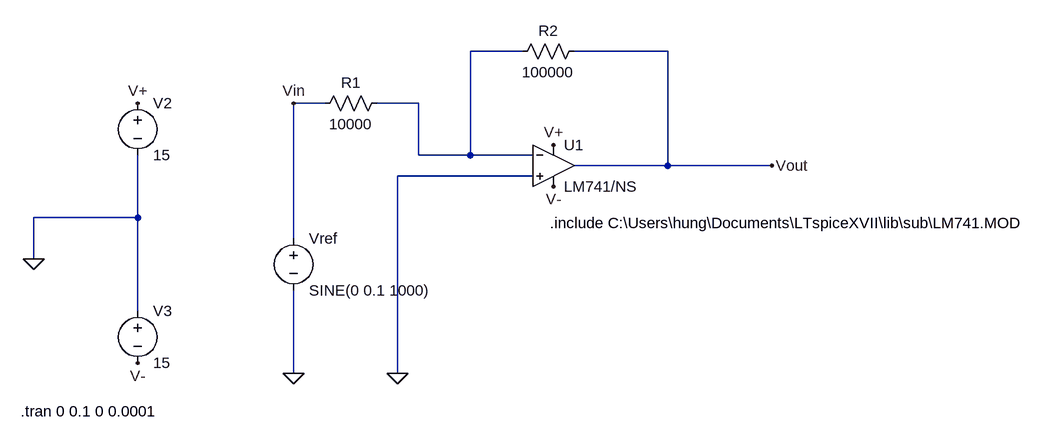
[diagram p0: schematic lab 7 start.asc]
lab 7 start.asc, the LTspice schematic file:
Version 4
SHEET 1 1036 680
WIRE 208 -112 128 -112
WIRE 432 -112 288 -112
WIRE -96 -32 -144 -32
WIRE 48 -32 -16 -32
WIRE 48 48 48 -32
WIRE 128 48 128 -112
WIRE 128 48 48 48
WIRE 224 48 128 48
WIRE 432 64 432 -112
WIRE 432 64 288 64
WIRE 592 64 432 64
WIRE 224 80 16 80
WIRE -384 144 -384 48
WIRE -384 144 -544 144
WIRE -144 176 -144 -32
WIRE -544 208 -544 144
WIRE -384 288 -384 144
WIRE -144 384 -144 256
WIRE 16 384 16 80
FLAG 256 32 V+
FLAG 256 96 V-
FLAG 592 64 Vout
FLAG -544 208 0
FLAG -144 384 0
FLAG 16 384 0
FLAG -384 -32 V+
FLAG -384 368 V-
FLAG -144 -32 Vin
SYMBOL Opamps\\opamp2 256 0 R0
SYMATTR InstName U1
SYMATTR Value LM741/NS
SYMBOL voltage -384 -48 R0
WINDOW 123 0 0 Left 0
WINDOW 39 0 0 Left 0
SYMATTR InstName V2
SYMATTR Value 15
SYMBOL voltage -384 272 R0
WINDOW 123 0 0 Left 0
WINDOW 39 0 0 Left 0
SYMATTR InstName V3
SYMATTR Value 15
SYMBOL voltage -144 160 R0
WINDOW 123 0 0 Left 0
WINDOW 39 0 0 Left 0
SYMATTR InstName Vref
SYMATTR Value SINE(0 0.1 1000)
SYMBOL res 0 -48 R90
WINDOW 0 0 56 VBottom 2
WINDOW 3 32 56 VTop 2
SYMATTR InstName R1
SYMATTR Value 10000
SYMBOL res 304 -128 R90
WINDOW 0 0 56 VBottom 2
WINDOW 3 32 56 VTop 2
SYMATTR InstName R2
SYMATTR Value 100000
TEXT 616 168 Bottom 2 !.include C:\\Users\\hung\\Documents\\LTspiceXVII\\lib\\sub\\LM741.MOD
TEXT -564 442 Left 2 !.tran 0 0.1 0 0.0001

The netlist it stands for:
* lab 7 start.asc
XU1 0 N001 V+ V- Vout LM741/NS  ; pins In+ In- V+ V- OUT
V2 V+ 0 15
V3 0 V- 15
Vref Vin 0 SINE(0 0.1 1000)
R1 N001 Vin 10000
R2 Vout N001 100000
.include C:\Users\hung\Documents\LTspiceXVII\lib\sub\LM741.MOD
.tran 0 0.1 0 0.0001
.backanno
.end